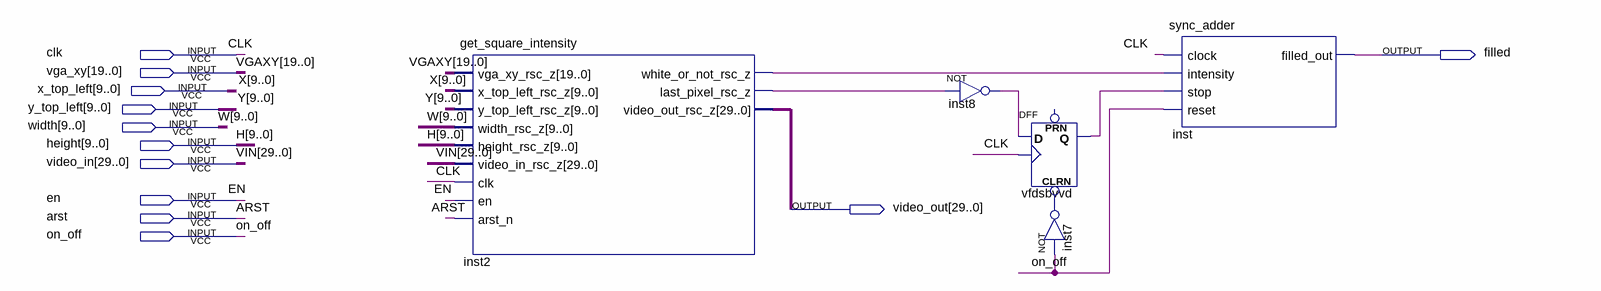
[diagram p0: schematic sheet]
// Quartus schematic rect.bdf as structural Verilog: 5 symbols, 12 pins
module rect (
  input  clk,
  input  [19:0] vga_xy,
  input  [9:0] x_top_left,
  input  [9:0] y_top_left,
  input  [9:0] width,
  input  [9:0] height,
  input  [29:0] video_in,
  input  en,
  input  arst,
  input  on_off,
  output filled,
  output [29:0] video_out
);

  wire inst2_last_pixel_rsc_z, inst2_white_or_not_rsc_z, inst7_out, inst8_out, vfdsbvvd_q;

  get_square_intensity inst2 (
    .vga_xy_rsc_z(vga_xy), .x_top_left_rsc_z(x_top_left), .y_top_left_rsc_z(y_top_left), .width_rsc_z(width),
    .height_rsc_z(height), .video_in_rsc_z(video_in), .clk(clk), .en(en), .arst_n(arst),
    .white_or_not_rsc_z(inst2_white_or_not_rsc_z), .last_pixel_rsc_z(inst2_last_pixel_rsc_z),
    .video_out_rsc_z(video_out));
  not inst8 (inst8_out, inst2_last_pixel_rsc_z);
  DFF vfdsbvvd (.CLRN(inst7_out), .CLK(clk), .D(inst8_out), .Q(vfdsbvvd_q));  // open: PRN
  not inst7 (inst7_out, on_off);
  sync_adder inst (
    .clock(clk), .intensity(inst2_white_or_not_rsc_z), .stop(vfdsbvvd_q), .reset(on_off), .filled_out(filled));

  // Other names for the same wires on the sheet: H[9:0] = height; VGAXY[19:0] = vga_xy; VIN[29:0] = video_in;
  //   W[9:0] = width; X[9:0] = x_top_left; Y[9:0] = y_top_left
endmodule
